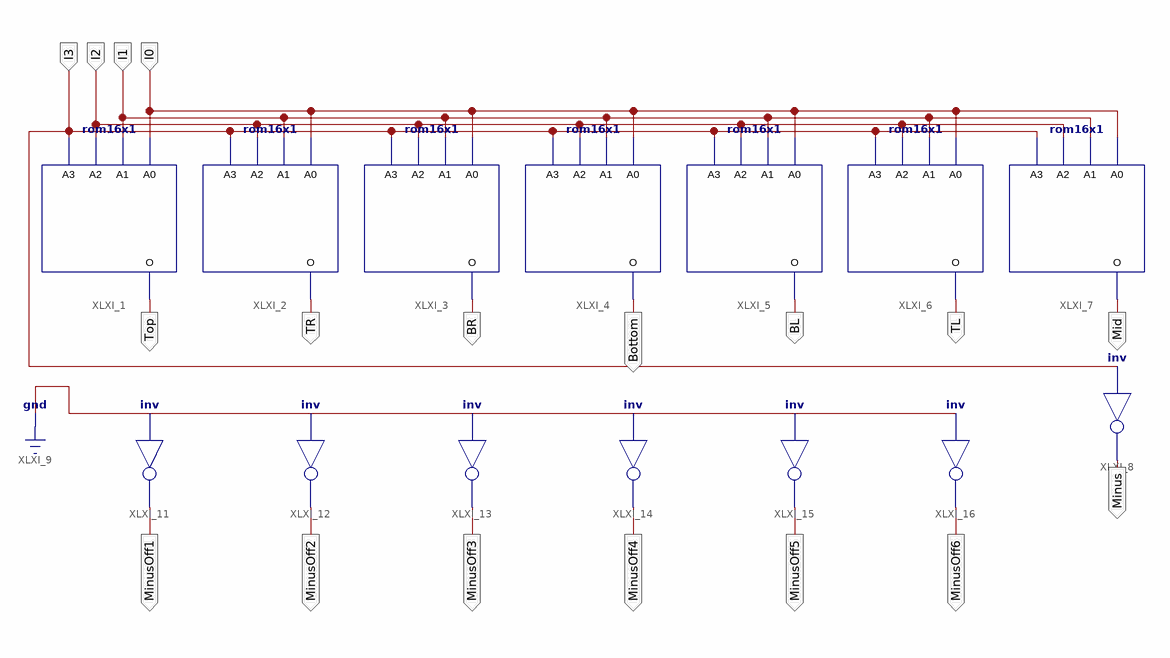
[diagram p0: schematic sheet 1]
// Xilinx ISE schematic LUT.sch (spartan3e) as structural Verilog: 14 symbols, 18 ports
module LUT (
  input  I3,
  input  I2,
  input  I1,
  input  I0,
  output Minus,
  output Top,
  output TR,
  output BR,
  output Bottom,
  output BL,
  output TL,
  output Mid,
  output MinusOff1,
  output MinusOff2,
  output MinusOff3,
  output MinusOff4,
  output MinusOff5,
  output MinusOff6
);

  rom16x1 #(.INIT("9012")) XLXI_1 (.A0(I0), .A1(I1), .A2(I2), .A3(I3), .O(Top));
  rom16x1 #(.INIT("0C60")) XLXI_2 (.A0(I0), .A1(I1), .A2(I2), .A3(I3), .O(TR));
  rom16x1 #(.INIT("4004")) XLXI_3 (.A0(I0), .A1(I1), .A2(I2), .A3(I3), .O(BR));
  rom16x1 #(.INIT("9292")) XLXI_4 (.A0(I0), .A1(I1), .A2(I2), .A3(I3), .O(Bottom));
  rom16x1 #(.INIT("BABA")) XLXI_5 (.A0(I0), .A1(I1), .A2(I2), .A3(I3), .O(BL));
  rom16x1 #(.INIT("E28E")) XLXI_6 (.A0(I0), .A1(I1), .A2(I2), .A3(I3), .O(TL));
  rom16x1 #(.INIT("8283")) XLXI_7 (.A0(I0), .A1(I1), .A2(I2), .A3(I3), .O(Mid));
  not XLXI_8 (Minus, I3);
  not XLXI_11 (MinusOff1, 1'b0);
  not XLXI_12 (MinusOff2, 1'b0);
  not XLXI_13 (MinusOff3, 1'b0);
  not XLXI_14 (MinusOff4, 1'b0);
  not XLXI_15 (MinusOff5, 1'b0);
  not XLXI_16 (MinusOff6, 1'b0);
endmodule
